# EAGLE design LP_rev1 (EAGLE 9.3.0)

## Sheet 1 of 2
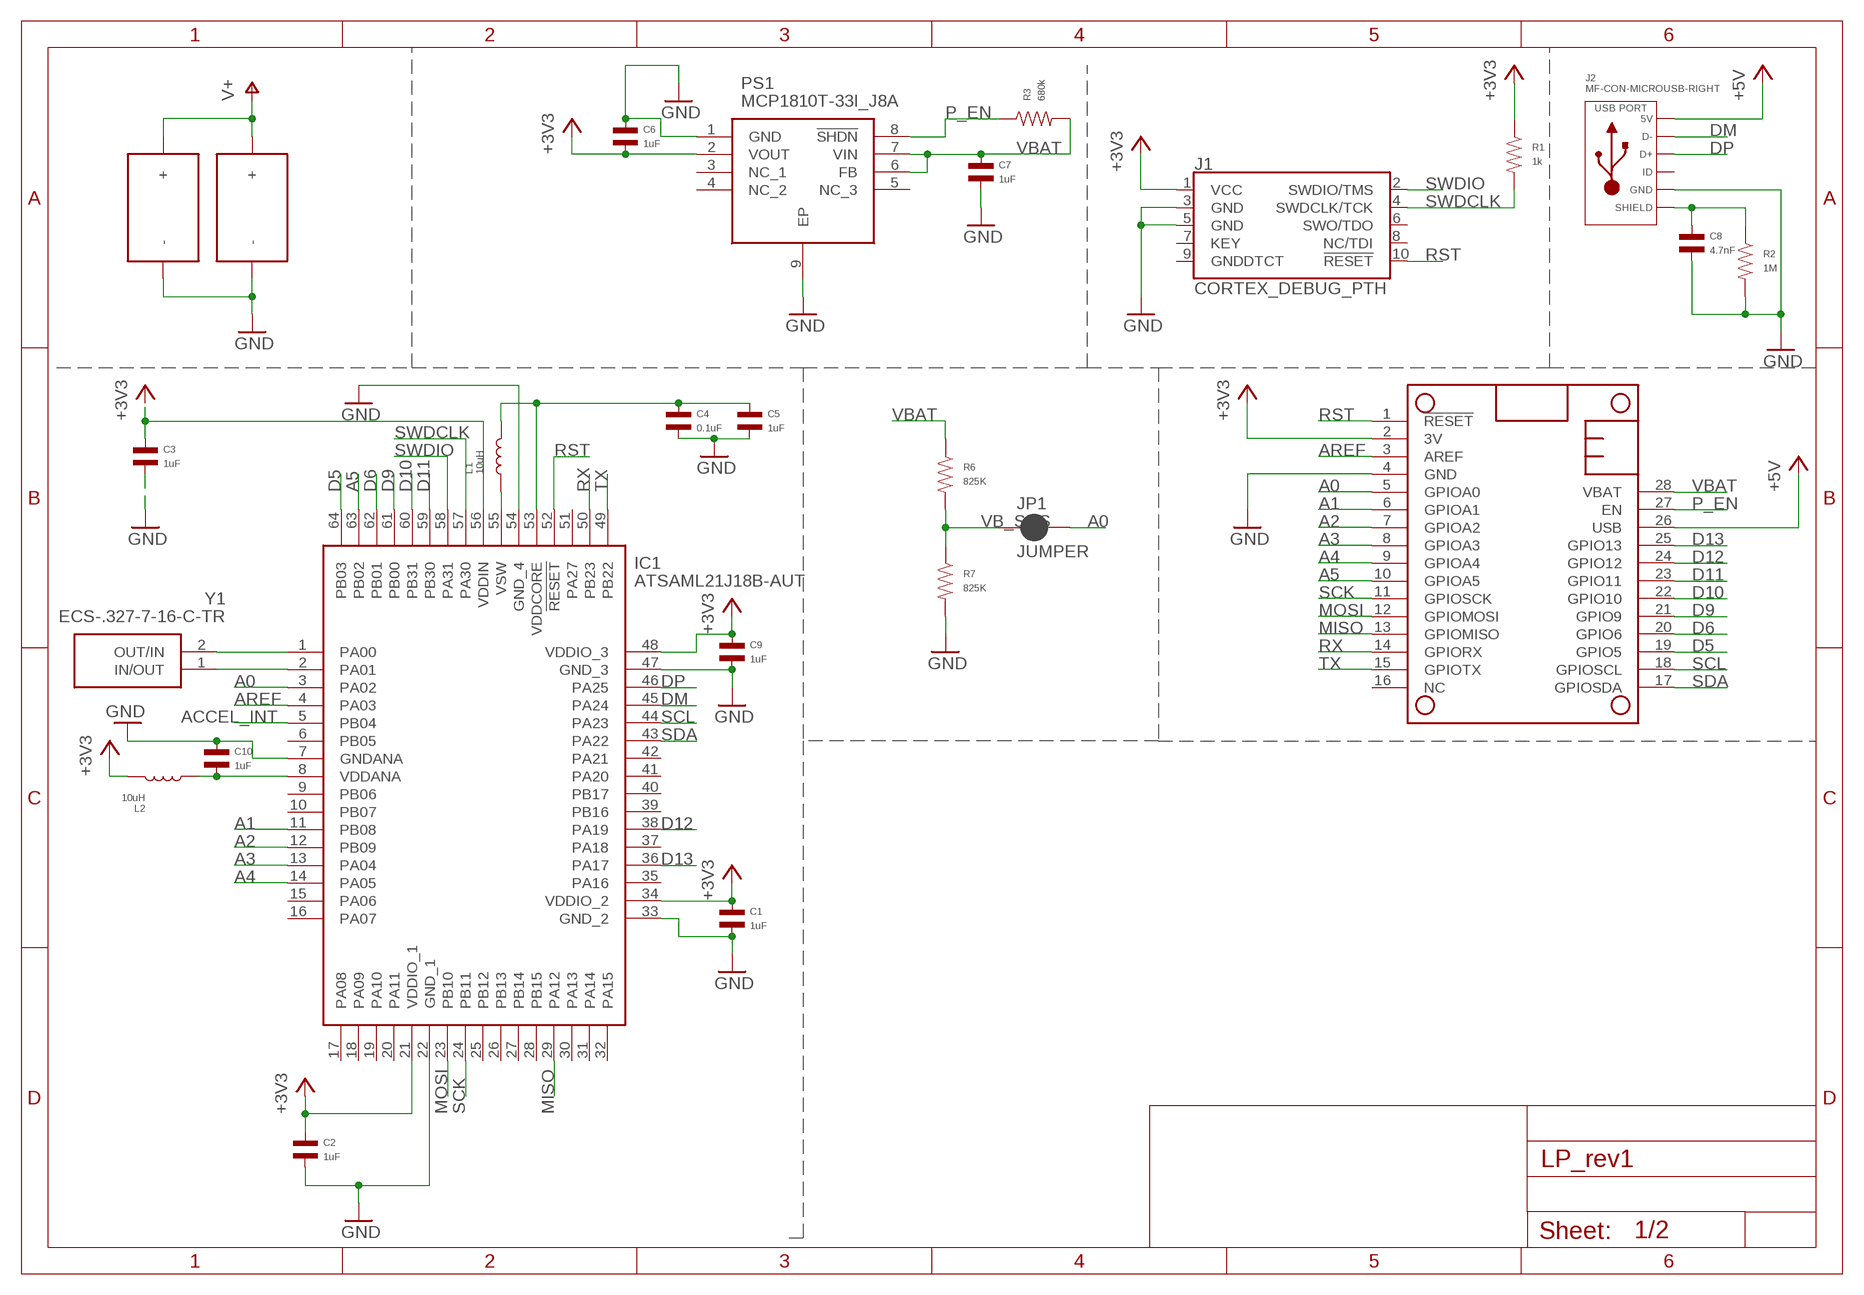
[diagram p0: schematic, sheet 1]

### Parts
C1  1uF  CAPACITOR_NP_0402  [C0402]
C2  1uF  CAPACITOR_NP_0402  [C0402]
C3  1uF  CAPACITOR_NP_0402  [C0402]
C4  0.1uF  CAPACITOR_NP_0402  [C0402]
C5  1uF  CAPACITOR_NP_0402  [C0402]
C6  1uF  CAPACITOR_NP_0402  [C0402]
C7  1uF  CAPACITOR_NP_0402  [C0402]
C8  4.7nF  CAPACITOR_NP_0402  [C0402]
C9  1uF  CAPACITOR_NP_0402  [C0402]
C10  1uF  CAPACITOR_NP_0402  [C0402]
IC1  ATSAML21J18B-AUT  [QFP50P1200X1200X120-64N]
J1  CORTEX_DEBUG_PTH  [2X5-PTH-1.27MM]
J2  MF-CON-MICROUSB-RIGHT  USB_MICRO_RIGHT  [MICROUSB-RIGHT]
JP1  JUMPER  JUMPER-SMT_2_NC_PASTE_NO-SILK  [SMT-JUMPER_2_NC_PASTE_NO-SILK]
L1  10uH  INDUCTOR_0603  [L0603]
L2  10uH  INDUCTOR_0603  [L0603]
MS1  FEATHERWING  [FEATHERWING]
PS1  MCP1810T-33I_J8A  [SON50P200X200X90-9N]
R1  1k  RESISTOR_0402  [R0402]
R2  1M  RESISTOR_0402  [R0402]
R3  680k  RESISTOR_0402  [R0402]
R6  825K  RESISTOR_0402  [R0402]
R7  825K  RESISTOR_0402  [R0402]
U$1  KXOB25-01X8F  [KXOB25-01X8F]
U$2  KXOB25-01X8F  [KXOB25-01X8F]
Y1  ECS-.327-7-16-C-TR  [ECS327516TR]

### Nets
+3V3: C1.P$1 C2.P$1 C3.P$1 C6.P$2 C9.P$1 IC1.21(VDDIO_1) IC1.34(VDDIO_2) IC1.48(VDDIO_3) IC1.56(VDDIN) J1.1(VCC) L2.P$2 MS1.2(3V) PS1.2(VOUT) R1.P$1 ; also sheet 2
+5V: J2.1(5V) MS1.26(USB)
A0: IC1.3(PA02) JP1.2 MS1.5(GPIOA0)
A1: IC1.11(PB08) MS1.6(GPIOA1)
A2: IC1.12(PB09) MS1.7(GPIOA2)
A3: IC1.13(PA04) MS1.8(GPIOA3)
A4: IC1.14(PA05) MS1.9(GPIOA4)
A5: IC1.63(PB02) MS1.10(GPIOA5)
ACCEL_INT: IC1.5(PB04) ; also sheet 2
AREF: IC1.4(PA03) MS1.3(AREF)
D5: IC1.64(PB03) MS1.19(GPIO5)
D6: IC1.62(PB01) MS1.20(GPIO6)
D9: IC1.61(PB00) MS1.21(GPIO9)
D10: IC1.60(PB31) MS1.22(GPIO10)
D11: IC1.59(PB30) MS1.23(GPIO11)
D12: IC1.38(PA19) MS1.24(GPIO12)
D13: IC1.36(PA17) MS1.25(GPIO13)
DM: IC1.45(PA24) J2.2(D-)
DP: IC1.46(PA25) J2.3(D+)
GND: C1.P$2 C2.P$2 C3.P$2 C4.P$2 C5.P$2 C6.P$1 C7.P$2 C8.P$2 C9.P$2 C10.P$1 IC1.7(GNDANA) IC1.22(GND_1) IC1.33(GND_2) IC1.47(GND_3) IC1.54(GND_4) J1.3(GND) J1.5(GND) J2.5(GND) MS1.4(GND) PS1.1(GND) PS1.9(EP) R2.P$2 R7.P$2 U$1.P$2(-) U$2.P$2(-) ; also sheet 2
MISO: IC1.29(PA12) MS1.13(GPIOMISO)
MOSI: IC1.23(PB10) MS1.12(GPIOMOSI)
N$1: C4.P$1 C5.P$1 IC1.53(VDDCORE) L1.P$2
N$2: IC1.1(PA00) Y1.2(OUT/IN)
N$3: IC1.2(PA01) Y1.1(IN/OUT)
N$4: C10.P$2 IC1.8(VDDANA) L2.P$1
N$5: C8.P$1 J2.S1(SLD) J2.S2(SLD) J2.S3(SLD) J2.S4(SLD) J2.S5(SLD) J2.S6(SLD) R2.P$1
N$6: IC1.55(VSW) L1.P$1
P_EN: MS1.27(EN) PS1.8(!SHDN) R3.P$1
RST: IC1.52(!RESET) J1.10(!RESET) MS1.1(!RESET)
RX: IC1.50(PB23) MS1.14(GPIORX)
SCK: IC1.24(PB11) MS1.11(GPIOSCK)
SCL: IC1.44(PA23) MS1.18(GPIOSCL) ; also sheet 2
SDA: IC1.43(PA22) MS1.17(GPIOSDA) ; also sheet 2
SWDCLK: IC1.57(PA30) J1.4(SWDCLK/TCK) R1.P$2
SWDIO: IC1.58(PA31) J1.2(SWDIO/TMS)
TX: IC1.49(PB22) MS1.15(GPIOTX)
V+: U$1.P$1(+) U$2.P$1(+) ; also sheet 2
VB_SNS: JP1.1 R6.P$2 R7.P$1
VBAT: C7.P$1 MS1.28(VBAT) PS1.6(FB) PS1.7(VIN) R3.P$2 R6.P$1 ; also sheet 2
Unconnected: IC1.6(PB05) IC1.9(PB06) IC1.10(PB07) IC1.15(PA06) IC1.16(PA07) IC1.17(PA08) IC1.18(PA09) IC1.19(PA10) IC1.20(PA11) IC1.25(PB12) IC1.26(PB13) IC1.27(PB14) IC1.28(PB15) IC1.30(PA13) IC1.31(PA14) IC1.32(PA15) IC1.35(PA16) IC1.37(PA18) IC1.39(PB16) IC1.40(PB17) IC1.41(PA20) IC1.42(PA21) IC1.51(PA27) J1.6(SWO/TDO) J1.7(KEY) J1.8(NC/TDI) J1.9(GNDDTCT) J2.4(ID) MS1.16(NC) PS1.3(NC_1) PS1.4(NC_2) PS1.5(NC_3)

## Sheet 2 of 2
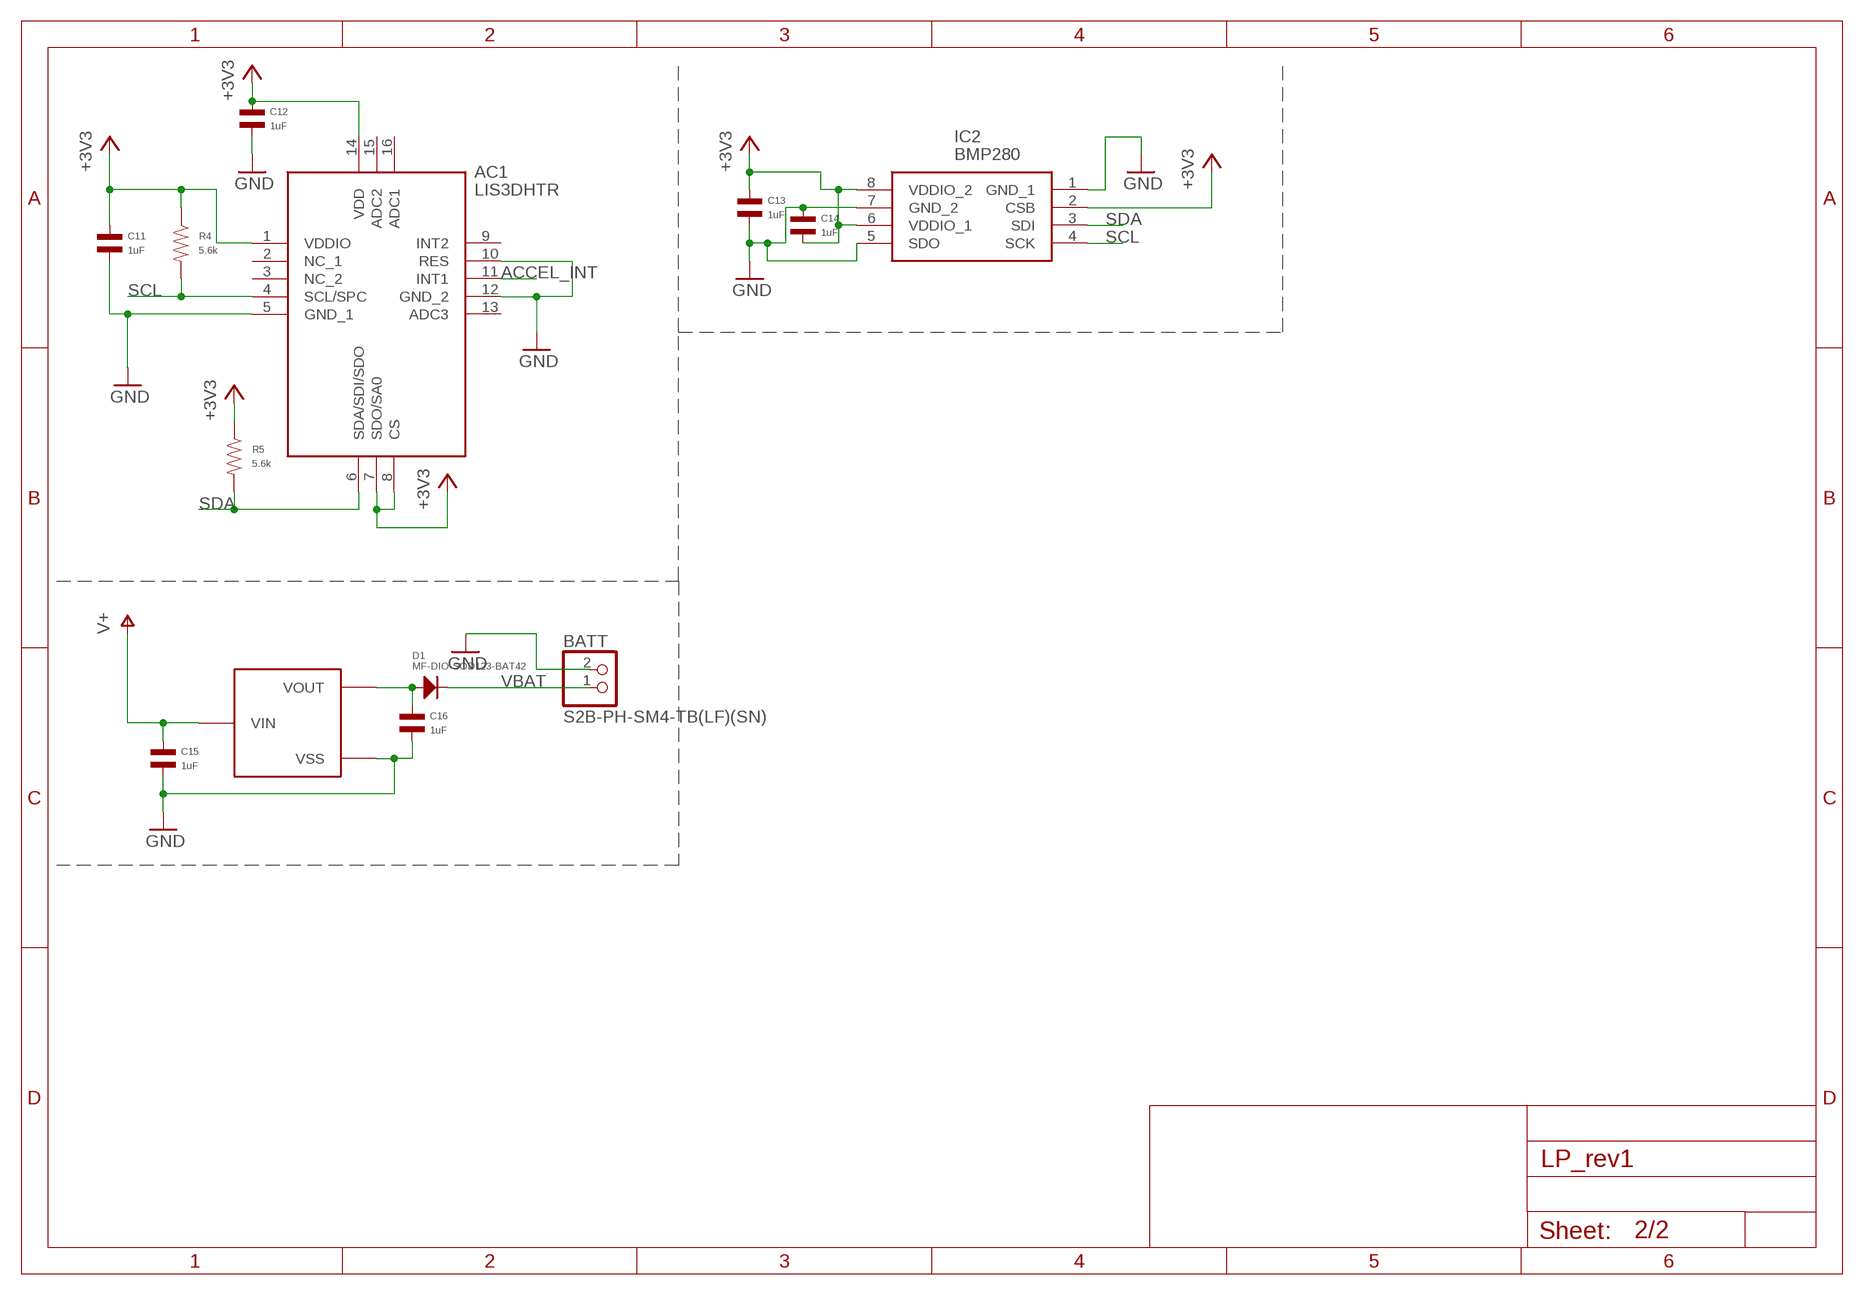
[diagram p1: schematic, sheet 2]

### Parts
AC1  LIS3DHTR  [PQFN50P300X300X100-16N]
BATT  S2B-PH-SM4-TB(LF)(SN)  JST_2PIN-SMT-RA  [JST-PH-2-SMT-RA]
C11  1uF  CAPACITOR_NP_0402  [C0402]
C12  1uF  CAPACITOR_NP_0402  [C0402]
C13  1uF  CAPACITOR_NP_0402  [C0402]
C14  1uF  CAPACITOR_NP_0402  [C0402]
C15  1uF  CAPACITOR_NP_0402  [C0402]
C16  1uF  CAPACITOR_NP_0402  [C0402]
D1  MF-DIO-SOD123-BAT42  DIODES_BAT42_SOD-123  [SOD-123]
IC2  BMP280  [8-PIN-METAL-LID-LGA]
R4  5.6k  RESISTOR_0402  [R0402]
R5  5.6k  RESISTOR_0402  [R0402]
U$3  XC6206P422MR-G  XC6206  [XC6206]

### Nets
+3V3: AC1.1(VDDIO) AC1.7(SDO/SA0) AC1.8(CS) AC1.14(VDD) C11.P$1 C12.P$1 C13.P$1 C14.P$2 IC2.2(CSB) IC2.6(VDDIO_1) IC2.8(VDDIO_2) R4.P$1 R5.P$1 ; also sheet 1
ACCEL_INT: AC1.11(INT1) ; also sheet 1
GND: AC1.5(GND_1) AC1.10(RES) AC1.12(GND_2) BATT.2 C11.P$2 C12.P$2 C13.P$2 C14.P$1 C15.P$2 C16.P$2 IC2.1(GND_1) IC2.5(SDO) IC2.7(GND_2) U$3.P$1(VSS) ; also sheet 1
N$10: C16.P$1 D1.ANODE U$3.P$2(VOUT)
SCL: AC1.4(SCL/SPC) IC2.4(SCK) R4.P$2 ; also sheet 1
SDA: AC1.6(SDA/SDI/SDO) IC2.3(SDI) R5.P$2 ; also sheet 1
V+: C15.P$1 U$3.P$3(VIN) ; also sheet 1
VBAT: BATT.1 D1.CATHODE ; also sheet 1
Unconnected: AC1.2(NC_1) AC1.3(NC_2) AC1.9(INT2) AC1.13(ADC3) AC1.15(ADC2) AC1.16(ADC1)

## Library data of the parts
AC1 = samacsys:LIS3DHTR: Accelerometer 3-Axis 2g/16g 1.8V LGA16 STMicroelectronics LIS3DHTR Accelerometer IC, 3-axis, I2C, SPI 1.71 3.6 V, 16-Pin LGA Source: Datasheet <http://www.st.com/web/en/resource/technical/document/datasheet/CD00274221.pdf>; ALLIED_NUMBER: 70521157; ALLIED_PRICE-STOCK: http://www.alliedelec.com/stmicroelectronics-lis3dhtr/70521157/; DESCRIPTION: Accelerometer 3-Axis 2g/16g 1.8V LGA16 STMicroelectronics LIS3DHTR Accelerometer IC, 3-axis, I2C, SPI 1.71 3.6 V, 16-Pin LGA; HEIGHT: 1mm; MANUFACTURER_NAME: STMicroelectronics; MANUFACTURER_PART_NUMBER: LIS3DHTR; MOUSER_PART_NUMBER: 511-LIS3DHTR; MOUSER_PRICE-STOCK: https://www.mouser.com/Search/Refine.aspx?Keyword=511-LIS3DHTR; RS_PART_NUMBER: 7931364P; RS_PRICE-STOCK: http://uk.rs-online.com/web/p/products/7931364P
BATT = adafruit:JST_2PIN: JST 2-Pin Connectors of various flavors SMT-RA (S2B-PH-SM4) 4UConnector #17311 SMT (B2B-PH-SM4) THM-RA (S2B-PH) THM (B2B-PH)
C1-C16 = MF_Passives:CAPACITOR_NP: Library: MF_Passives Description: Device for Non-Polarized Capacitors. Manufacture part number (MPN) can be added via Attributes. Check https://factory.macrofab.com/parts for the house parts list.; POPULATE: 1
D1 = MF_Discrete_Semiconductor:DIODES: Library: MF_Discrete_Semiconductor Description: Device for Single Packaged Diodes.; HOUSEPART: YES; MPN: MF-DIO-SOD123-BAT42; POPULATE: 1; URL: https://factory.macrofab.com/part/MF-DIO-SOD123-BAT42
IC1 = samacsys:ATSAML21J18B-AUT: MICROCHIP - ATSAML21J18B-AUT. - Cortex-MO+,256KBFLASH, 32 KBSRAM, USB, U Source: Datasheet <http://ww1.microchip.com/downloads/en/DeviceDoc/60001477A.pdf>; DESCRIPTION: MICROCHIP - ATSAML21J18B-AUT. - Cortex-MO+,256KBFLASH, 32 KBSRAM, USB, U; HEIGHT: 1.2mm; MANUFACTURER_NAME: Microchip; MANUFACTURER_PART_NUMBER: ATSAML21J18B-AUT; MOUSER_PART_NUMBER: 556-ATSAML21J18B-AUT; MOUSER_PRICE-STOCK: https://www.mouser.com/Search/Refine.aspx?Keyword=556-ATSAML21J18B-AUT
IC2 = samacsys:BMP280: Digital Pressure Sensor Source: Datasheet <https://ae-bst.resource.bosch.com/media/products/dokumente/bmp280/BST-BMP280-DS001-11.pdf>; DESCRIPTION: Digital Pressure Sensor; HEIGHT: mm; MANUFACTURER_NAME: Bosch Sensortec; MANUFACTURER_PART_NUMBER: bmp280; MOUSER_PART_NUMBER: 262-BMP280; MOUSER_PRICE-STOCK: https://www.mouser.com/Search/Refine.aspx?Keyword=262-BMP280
J1 = SparkFun-Connectors:CORTEX_DEBUG: Cortex Debug Connector - 10 pin Supports JTAG debug, Serial Wire debug, and Serial Wire Viewer. PTH and SMD connector options available. General Connector Information <http://infocenter.arm.com/help/topic/com.arm.doc.faqs/attached/13634/cortex_debug_connectors.pdf> Products: PTH Connector <http://www.digikey.com/product-detail/en/cnc-tech/3220-10-0100-00/1175-1627-ND/3883661> -via Digi-Key SparkFun PSoc <https://www.sparkfun.com/products/13229> SparkFun T <https://www.sparkfun.com/products/13810>
J2 = MF_Connectors:USB: Library: MF_Connectors Description: 5 Pin USB Connectors. SLD is the shield connection. Usually tied to ground through a small ferrite bead.; HOUSEPART: YES; MPN: MF-CON-MICROUSB-RIGHT; POPULATE: 1; URL: https://factory.macrofab.com/part/MF-CON-MICROUSB-RIGHT
JP1 = SparkFun-Jumpers:JUMPER-SMT_2_NC_PASTE: Normally closed solder jumper This jumper has an aperture in the stencil to allow solder paste to bridge the split in the wire so it's normally closed (NC). Wick off the solder to open the connection. Reapply solder to reclose the connection.
L1 L2 = MF_Passives:INDUCTOR: Library: MF_Passives Description: Device for Inductors. Manufacture part number (MPN) can be added via Attributes. Check https://factory.macrofab.com/parts for the house parts list.; POPULATE: 1
MS1 = adafruit:FEATHERWING
PS1 = samacsys:MCP1810T-33I_J8A: LDO Regulator 150mA 3.3V Low IQ VDFN8 Source: Datasheet <https://componentsearchengine.com/Datasheets/2/MCP1810T-33I_J8A.pdf>; DESCRIPTION: LDO Regulator 150mA 3.3V Low IQ VDFN8; HEIGHT: 0.9mm; MANUFACTURER_NAME: Microchip; MANUFACTURER_PART_NUMBER: MCP1810T-33I/J8A; MOUSER_PART_NUMBER: 579-MCP1810T-33I/J8A; MOUSER_PRICE-STOCK: https://www.mouser.com/Search/Refine.aspx?Keyword=579-MCP1810T-33I%2FJ8A; RS_PART_NUMBER: 1468894P; RS_PRICE-STOCK: http://uk.rs-online.com/web/p/products/1468894P
R1-R7 = MF_Passives:RESISTOR: Library: MF_Passives Description: Device for Resistors. Manufacture part number (MPN), Voltage, Tolerance, and Wattage Rating can be added via Attributes. Check https://factory.macrofab.com/parts for the house parts list.; POPULATE: 1
U$1 U$2 = ixys:KXOB25-01X8F
U$3 = torex:XC6206
Y1 = samacsys:ECS-.327-7-16-C-TR: Crystals 32.768kHz 7pF 10ppm -40C +85C Source: Datasheet <https://www.mouser.com/datasheet/2/122/ECX-16-845175.pdf>; DESCRIPTION: Crystals 32.768kHz 7pF 10ppm -40C +85C; HEIGHT: 0.5mm; MANUFACTURER_NAME: ECS; MANUFACTURER_PART_NUMBER: ECS-.327-7-16-C-TR; MOUSER_PART_NUMBER: 520-.327-7-16-CT; MOUSER_PRICE-STOCK: https://www.mouser.com/Search/Refine.aspx?Keyword=520-.327-7-16-CT

## Board
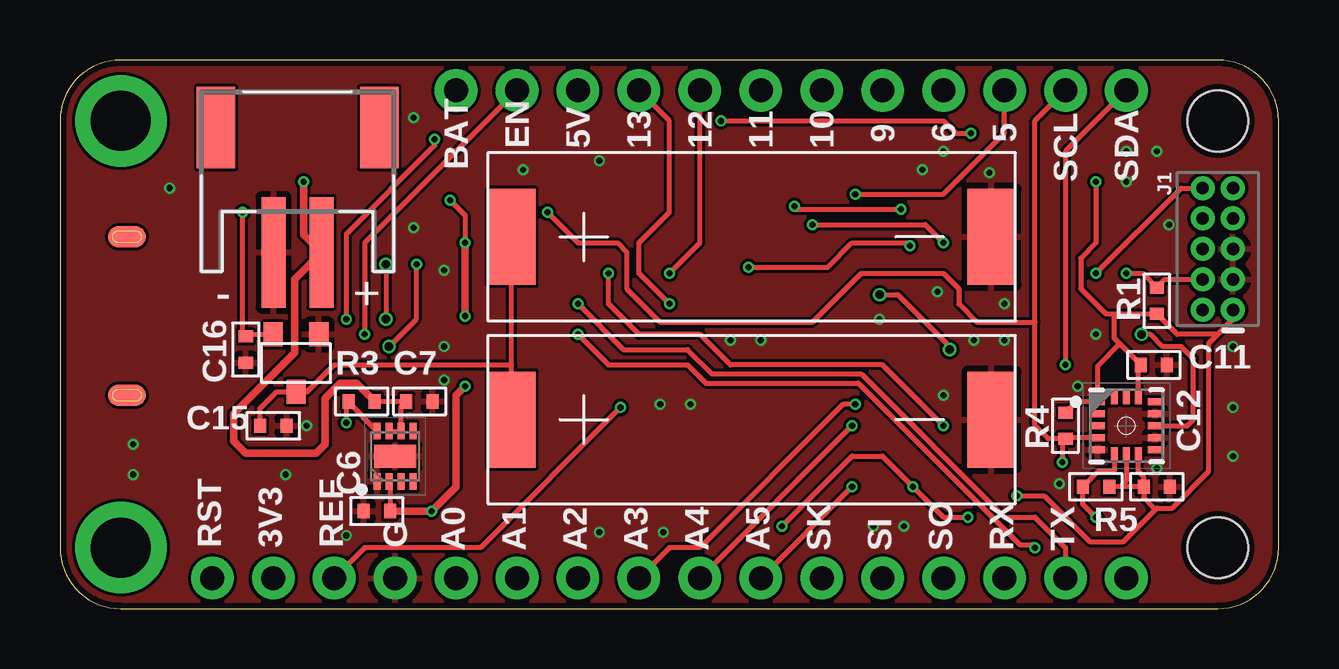
[diagram p2: board, top side]
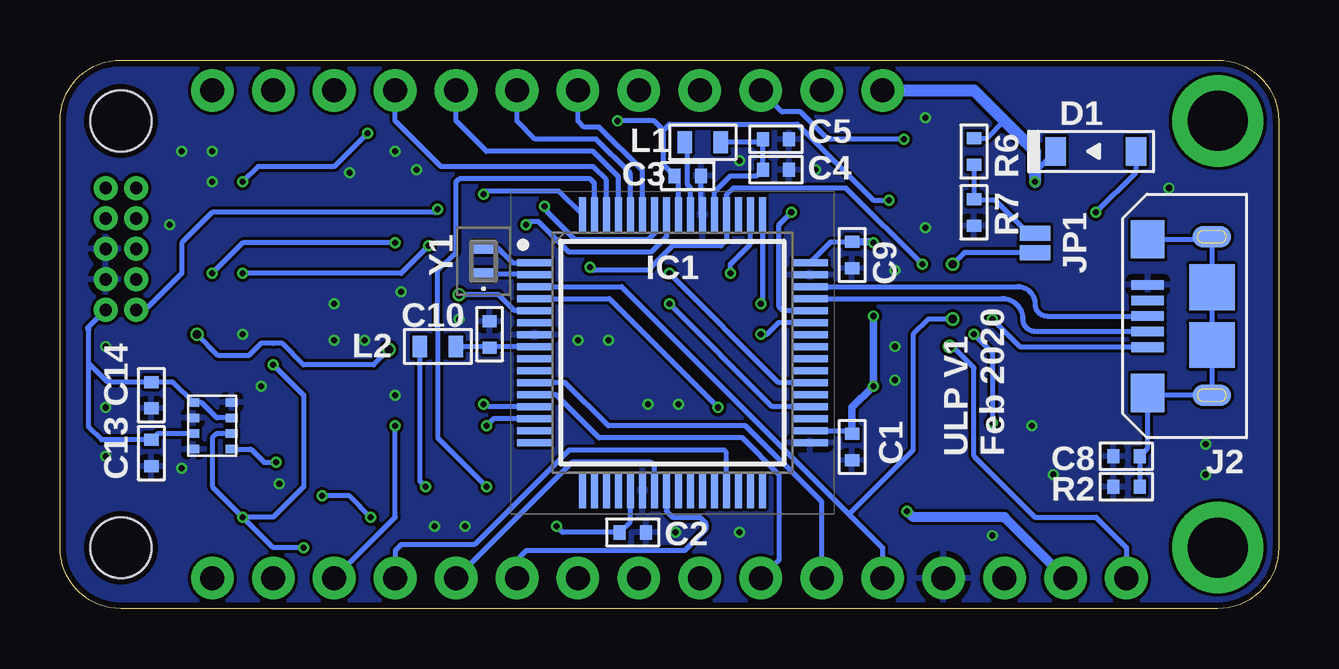
[diagram p3: board, bottom side, seen from below]

Size 50.8 x 22.86 mm. Coordinates in mm from the lower left corner, seen from the top.
Copper layers (1*16): Top 0.035mm / dielectric 1.5mm / Bottom 0.035mm
Design rules "MF_Standard_2_Layer": minimum track width 5mil, minimum drill 10mil, track to track 5mil, track to pad 5mil, pad to pad 5mil, via to via 5mil, smd to smd 0mil, copper to edge 10mil, drill to drill 10mil, minimum pad ring 4mil, minimum via ring 4mil, stop-mask expansion 2mil, vias tented up to drill 25mil, thermal gap 10mil

### Footprints (pad centres in the part's own frame; a part is rotated, then mirrored left to right if it is on the bottom)
PQFN50P300X300X100-16N = smd 0.6 x 0.3: 1 -1.2,1; 2 -1.2,0.5; 3 -1.2,0; 4 -1.2,-0.5; 5 -1.2,-1; 9 1.2,-1; 10 1.2,-0.5; 11 1.2,0; 12 1.2,0.5; 13 1.2,1 | smd 0.3 x 0.6: 6 -0.5,-1.2; 7 0,-1.2; 8 0.5,-1.2; 14 0.5,1.2; 15 0,1.2; 16 -0.5,1.2
JST-PH-2-SMT-RA = smd 1 x 4.6: 1 1,-3.7; 2 -1,-3.7 | smd 1.6 x 3.4: NC1 -3.4,1.5; NC2 3.4,1.5
C0402 = smd 0.5 x 0.6: P$1 -0.55,0; P$2 0.55,0
SOD-123 = smd 0.85 x 1.2: ANODE 1.675,0; CATHODE -1.675,0
QFP50P1200X1200X120-64N = smd 1.475 x 0.3: 1 -5.738,3.75; 2 -5.738,3.25; 3 -5.738,2.75; 4 -5.738,2.25; 5 -5.738,1.75; 6 -5.738,1.25; 7 -5.738,0.75; 8 -5.738,0.25; 9 -5.738,-0.25; 10 -5.738,-0.75; 11 -5.738,-1.25; 12 -5.738,-1.75; 13 -5.738,-2.25; 14 -5.738,-2.75; 15 -5.738,-3.25; 16 -5.738,-3.75; 33 5.738,-3.75; 34 5.738,-3.25; 35 5.738,-2.75; 36 5.738,-2.25; 37 5.738,-1.75; 38 5.738,-1.25; 39 5.738,-0.75; 40 5.738,-0.25; 41 5.738,0.25; 42 5.738,0.75; 43 5.738,1.25; 44 5.738,1.75; 45 5.738,2.25; 46 5.738,2.75; 47 5.738,3.25; 48 5.738,3.75 | smd 0.3 x 1.475: 17 -3.75,-5.738; 18 -3.25,-5.738; 19 -2.75,-5.738; 20 -2.25,-5.738; 21 -1.75,-5.738; 22 -1.25,-5.738; 23 -0.75,-5.738; 24 -0.25,-5.738; 25 0.25,-5.738; 26 0.75,-5.738; 27 1.25,-5.738; 28 1.75,-5.738; 29 2.25,-5.738; 30 2.75,-5.738; 31 3.25,-5.738; 32 3.75,-5.738; 49 3.75,5.738; 50 3.25,5.738; 51 2.75,5.738; 52 2.25,5.738; 53 1.75,5.738; 54 1.25,5.738; 55 0.75,5.738; 56 0.25,5.738; 57 -0.25,5.738; 58 -0.75,5.738; 59 -1.25,5.738; 60 -1.75,5.738; 61 -2.25,5.738; 62 -2.75,5.738; 63 -3.25,5.738; 64 -3.75,5.738
8-PIN-METAL-LID-LGA = smd 0.5 x 0.35: 1 0.8,0.975; 2 0.8,0.325; 3 0.8,-0.325; 4 0.8,-0.975; 5 -0.8,-0.975; 6 -0.8,-0.325; 7 -0.8,0.325; 8 -0.8,0.975
2X5-PTH-1.27MM = drill 0.508 pad 1: 1 -2.54,-0.635; 2 -2.54,0.635; 3 -1.27,-0.635; 4 -1.27,0.635; 5 0,-0.635; 6 0,0.635; 7 1.27,-0.635; 8 1.27,0.635; 9 2.54,-0.635; 10 2.54,0.635
MICROUSB-RIGHT = smd 0.4 x 1.35: 1 -1.3,1.27; 2 -0.65,1.27; 3 0,1.27; 4 0.65,1.27; 5 1.3,1.27 | smd 0.9 x 1.6: S1 -3.3,-1.4; S2 3.3,-1.4 | smd 1.6 x 1.4: S3 -3.2,1.27; S4 3.2,1.27 | smd 1.9 x 1.9: S5 -1.2,-1.405; S6 1.2,-1.405 | smd 0.9 x 1.6 bottom: S7 -3.3,-1.4; S8 3.3,-1.4
SMT-JUMPER_2_NC_PASTE_NO-SILK = smd 0.635 x 1.27: 1 -0.406,0; 2 0.406,0
L0603 = smd 0.6 x 0.9: P$1 -0.75,0; P$2 0.75,0
FEATHERWING = drill 1 pad 1.778: 1 6.35,1.27; 2 8.89,1.27; 3 11.43,1.27; 4 13.97,1.27; 5 16.51,1.27; 6 19.05,1.27; 7 21.59,1.27; 8 24.13,1.27; 9 26.67,1.27; 10 29.21,1.27; 11 31.75,1.27; 12 34.29,1.27; 13 36.83,1.27; 14 39.37,1.27; 15 41.91,1.27; 16 44.45,1.27; 17 44.45,21.59; 18 41.91,21.59; 19 39.37,21.59; 20 36.83,21.59; 21 34.29,21.59; 22 31.75,21.59; 23 29.21,21.59; 24 26.67,21.59; 25 24.13,21.59; 26 21.59,21.59; 27 19.05,21.59; 28 16.51,21.59 | drill 2.5 pad 3.81: P$1 2.54,20.32; P$2 2.54,2.54 | hole 2.54: 48.26,20.32; 48.26,2.54
SON50P200X200X90-9N = smd 0.7 x 0.3: 1 -1.05,0.75; 2 -1.05,0.25; 3 -1.05,-0.25; 4 -1.05,-0.75; 5 1.05,-0.75; 6 1.05,-0.25; 7 1.05,0.25; 8 1.05,0.75 | smd 0.95 x 1.75: 9 0,0
R0402 = smd 0.5 x 0.6: P$1 -0.55,0; P$2 0.55,0
KXOB25-01X8F = smd 2 x 4: P$1 -10,0; P$2 10,0
XC6206 = smd 0.8 x 1: P$1 0,0; P$2 1.9,0; P$3 0.95,2.4
ECS327516TR = smd 0.5 x 1: 1 -0.55,0; 2 0.55,0

### Placement (x,y rotation side)
AC1  44.45,7.62 0 top
BATT  9.91,18.54 0 top
C1  17.78,6.73 270 bottom
C2  26.92,3.17 0 bottom
C3  24.64,18.03 0 bottom
C4  20.95,18.29 0 bottom
C5  20.95,19.56 0 bottom
C6  13.21,4.06 0 top
C7  14.99,8.64 0 top
C8  6.35,6.35 180 bottom
C9  17.78,14.73 270 bottom
C10  32.89,11.43 270 bottom
C11  45.59,10.16 0 top
C12  45.72,5.08 0 top
C13  46.99,6.48 270 bottom
C14  46.99,8.89 90 bottom
C15  8.89,7.62 0 top
C16  7.75,10.79 270 top
D1  7.62,19.05 0 bottom
IC1  25.27,10.67 0 bottom
IC2  44.45,7.62 0 bottom
J1  48.26,14.99 90 top
J2  4.19,12.19 90 bottom
JP1  10.16,15.24 270 bottom
L1  24,19.43 0 bottom
L2  35.05,10.92 180 bottom
MS1  0,0 0 top
PS1  13.97,6.35 90 top
R1  45.72,12.83 90 top
R2  6.35,5.08 180 bottom
R3  12.57,8.64 0 top
R4  41.91,7.62 270 top
R5  43.18,5.08 180 top
R6  12.7,19.05 270 bottom
R7  12.7,16.51 270 bottom
U$1  28.83,15.49 0 top
U$2  28.83,7.87 0 top
U$3  10.79,11.43 180 top
Y1  33.15,14.48 90 bottom

### Tracks (layer width: path | path; a pad name or v marks a point on that pad's centre or on a via)
+3V3  (via drill 0.25)
  Top 0.203: R4.P$1 42.36,8.62 AC1.1 43.25,10.1 44.17,11.03 | C12.P$1 45.17,5.5 44.95,5.72 AC1.8 | AC1.7 44.45,5.33 44.2,5.08 | 44.2,5.08 R5.P$1 | AC1.14 44.95,10.07 C11.P$1 44.17,11.03 | J1.1 48.9,12.06 48.26,11.43 | 48.26,11.43 46.57,11.43 R1.P$1 43.94,12.28 | C12.P$1 44.2,5.08 | C12.P$1 45.17,4.61 45.59,4.19 45.72,4.19 | 45.72,4.19 46.35,4.19 47.88,5.71 47.88,11.05 48.26,11.43 | PS1.2 13.76,5.26 C6.P$2 | v16.26,17.02 16.89,16.38 v16.89,15.24 | v30.1,3.43 33.02,6.35 34.29,6.35 v35.56,5.08 36.83,3.81 v37.85,3.81 | v39.88,4.7 41.02,4.7 42.93,2.79 44.32,2.79 45.72,4.19 | v27.56,20.32 36.83,20.32 37.34,19.81 v37.97,19.81 | v43.18,17.78 43.18,15.24 42.55,14.61 42.55,13.34 43.6,12.28 43.94,12.28 | 44.17,11.03 43.94,11.26 43.94,12.28
  Top 0.305: C6.P$2 v15.49,4.06 16.51,5.08 16.51,8.89 v16.89,9.27 | v16.89,12.19 v16.89,15.24
  Bottom 0.203: IC1.48 18.67,15.28 C9.P$1 | IC1.34 17.92,7.42 C1.P$1 | IC1.21 27.02,3.63 C2.P$1 29.84,3.17 v30.1,3.43 | IC1.56 25.02,17.87 C3.P$1 25.65,18.5 25.65,19.94 | IC2.6 46.72,7.29 C13.P$1 49.06,7.03 49.59,7.56 49.59,10.16 | IC2.2 44.27,7.95 44.92,8.6 IC2.8 46.09,9.44 C14.P$2 48.81,9.44 49.53,10.16 49.59,10.16 | 25.65,19.94 25.4,20.19 20.07,20.19 16.89,17.02 v16.26,17.02 | v37.85,3.81 38.73,4.7 v39.88,4.7 | L2.P$2 35.8,5.32 v35.56,5.08 | 25.65,19.94 26.04,20.32 v27.56,20.32 | v37.97,19.81 39.37,18.41 42.55,18.41 v43.18,17.78 | J1.1 49.66,11.68 49.59,11.62 49.59,10.16
  Bottom 0.305: C1.P$1 17.78,8.38 v16.89,9.27 v16.89,12.19 | v16.89,15.24 16.93,15.28 C9.P$1
  Bottom 0.406: MS1.2 11.43,3.81 15.24,3.81 v15.49,4.06
+5V  (via drill 0.25)
  Top 0.203: v11.94,12.06 11.94,15.62 15.62,19.3 v15.62,19.56
  Bottom 0.203: J2.1 10.77,10.89 v11.94,12.06 | v15.62,19.56 18.8,19.56 19.94,20.7 20.7,20.7 MS1.26
A0  (via drill 0.35)
  Top 0.203: v13.59,14.35 v13.59,12.06
  Bottom 0.203: IC1.3 27.39,13.42 17.91,3.94 | MS1.5 16.51,2.54 17.91,3.94 | JP1.2 13.11,14.83 v13.59,14.35 | v13.59,12.06 14.61,12.06 15.24,11.43 15.24,6.6 17.91,3.94
A1
  Bottom 0.203: MS1.6 19.05,4.45 22.23,7.62 27.94,7.62 29.74,9.42 IC1.11
A2
  Bottom 0.203: MS1.7 20.83,2.03 20.83,5.59 22.35,7.11 28.32,7.11 30.13,8.92 IC1.12
A3  (via drill 0.25)
  Top 0.203: v33.15,8.51 32.64,8.51 26.67,2.54 25.4,2.54 MS1.8
  Bottom 0.203: IC1.13 32.93,8.42 33.02,8.51 v33.15,8.51
A4  (via drill 0.25)
  Top 0.203: v33.02,7.62 MS1.9
  Bottom 0.203: IC1.14 32.72,7.92 v33.02,7.62
A5  (via drill 0.25)
  Top 0.203: v33.02,5.08 MS1.10
  Bottom 0.203: IC1.63 28.52,17.73 28.7,17.91 34.16,17.91 34.29,17.78 34.29,14.86 35.05,14.1 35.05,11.68 35.05,11.43 35.05,7.11 v33.02,5.08
ACCEL_INT  (via drill 0.35)
  Top 0.203: v34.16,13.08 34.92,13.08 37.08,10.92 v37.08,10.79 | AC1.11 46.99,7.62 47.24,7.87 47.24,10.41 46.74,10.92 45.97,10.92 45.47,11.43 v45.09,11.43
  Bottom 0.203: IC1.5 31.85,12.42 32.51,13.08 v34.16,13.08 | v37.08,10.79 37.72,10.16 40.64,10.16 41.53,11.05 41.91,11.05 42.42,11.05 42.93,10.54 44.2,10.54 v45.09,11.43
AREF  (via drill 0.25)
  Top 0.203: v23.37,8.38 17.53,2.54 12.7,2.54 MS1.3
  Bottom 0.203: IC1.4 27.9,12.92 v23.37,8.38
D5  (via drill 0.25)
  Top 0.203: MS1.19 39.37,19.81 36.83,17.27 v33.15,17.27
  Bottom 0.203: IC1.64 30.02,17.4 33.02,17.4 v33.15,17.27
D6
  Bottom 0.203: IC1.62 28.02,17.86 28.57,18.41 34.92,18.41 36.83,20.32 MS1.20
D9
  Bottom 0.203: IC1.61 27.52,18 28.57,19.05 33.02,19.05 34.29,20.32 MS1.21
D10
  Bottom 0.203: IC1.60 27.02,18.13 28.45,19.56 30.99,19.56 31.75,20.32 MS1.22
D11
  Bottom 0.203: IC1.59 26.52,18.27 28.32,20.07 28.96,20.07 29.21,20.32 MS1.23
D12  (via drill 0.25)
  Top 0.203: v25.4,13.97 26.67,15.24 MS1.24
  Bottom 0.203: IC1.38 20.85,9.42 v25.4,13.97
D13  (via drill 0.25)
  Top 0.203: v25.4,12.7 24.13,13.97 24.13,15.24 25.4,16.51 25.4,20.32 MS1.25
  Bottom 0.203: IC1.36 21.12,8.42 v25.4,12.7
DM
  Bottom 0.203: 5.48,11.56 arc90 J2.2 arc-90 5.48,11.56 | IC1.45 11.52,12.92 arc90 10.67,12.06 arc-90 10.16,11.56 5.48,11.56
DP
  Bottom 0.203: IC1.46 10.88,13.42 arc90 10.16,12.7 arc-90 9.65,12.19 J2.3
GND  (via drill 0.25)
  Bottom 0.203: IC1.54 24.09,16.47 C3.P$2
  other vias: 36.83,8.89 39.37,11.18 34.16,12.06 43.18,11.43 44.45,19.05 45.72,19.05 38.73,18.16 25.02,8.51 26.29,8.51 22.48,3.17 25.15,3.17 11.94,3.05 9.4,5.59 3.05,6.86 3.05,5.59 4.57,17.53 14.73,20.45 19.3,18.29 22.48,18.67 16,14.1 38.1,11.18 36.58,13.21 36.83,19.05 35.94,18.29 44.45,17.78 46.23,16 27.94,11.18 29.21,11.18 39.37,12.7 48.9,8.38 48.9,6.35 42.42,9.27 41.66,5.21 45.72,5.84 10.29,7.62 33.91,3.43 35.18,3.43 14.73,15.88 16,10.92 16,9.53 48.9,10.92
  pour Top: 0,0 52.07,0 52.07,24.13 0,24.13
  pour Bottom: 0,0 53.34,0 53.34,25.4 0,25.4
MISO
  Bottom 0.203: IC1.29 23.02,6.51 23.11,6.6 29.59,6.6 33.53,2.67 36.58,2.67 36.83,2.41 MS1.13
MOSI
  Bottom 0.203: IC1.23 26.02,5.96 26.16,6.1 29.46,6.1 MS1.12
N$1
  Bottom 0.203: L1.P$2 21.63,19.43 C5.P$1 C4.P$1 21.76,18.03 22.86,18.03 23.52,17.37 IC1.53
N$2
  Bottom 0.203: Y1.2 32.55,15.03 31.94,14.42 IC1.1
N$3
  Bottom 0.203: IC1.2 31.02,13.93 Y1.1
N$4
  Bottom 0.203: IC1.8 32.85,10.92 C10.P$2 32.94,10.92 L2.P$1
N$5
  Bottom 0.203: R2.P$1 C8.P$1 5.46,6.69 J2.S3 5.36,8.89 J2.S1 J2.S5 J2.S6 J2.S2 2.89,15.39 J2.S4
N$6
  Bottom 0.203: IC1.55 24.52,17.54 24.64,17.65 24.64,19.32 L1.P$1
N$10  (via drill 0.25)
  Top 0.203: U$3.P$2 7.83,11.43 C16.P$1 7.62,11.47 v7.62,16.51
  Bottom 0.203: v7.62,16.51 5.95,18.18 D1.ANODE
P_EN  (via drill 0.25)
  Top 0.203: PS1.8 12.02,8.6 R3.P$1 11.94,8.55 v11.94,7.75 | MS1.27 12.7,15.24 v12.7,11.43
  Bottom 0.203: v12.7,11.43 11.94,10.67 v11.94,7.75
RST  (via drill 0.25, 0.35)
  Top 0.203: v28.7,14.22 32,14.22 33.02,15.24 35.31,15.24 v35.43,15.11 | v43.18,13.97 46.74,17.53 J1.10 | v14.86,14.35 14.86,12.06 v13.72,10.92
  Bottom 0.203: v28.7,14.22 28.57,14.1 26.29,14.1 25.27,15.11 23.24,15.11 23.02,15.33 IC1.52 23.02,17.24 22.73,17.53 18.03,17.53 v14.86,14.35 | v35.43,15.11 36.58,13.97 v43.18,13.97 | MS1.1 6.35,2.54 7.62,3.81 10.16,3.81 12.7,6.35 12.7,10.03 13.59,10.92 v13.72,10.92
RX  (via drill 0.25)
  Top 0.203: v36.83,7.62 34.29,10.16 27.94,10.16 26.67,11.43 24.13,11.43 22.86,12.7 v22.86,13.97
  Bottom 0.203: MS1.14 36.83,3.81 v36.83,7.62 | v22.86,13.97 22.86,14.35 22.02,15.19 IC1.50
SCK
  Bottom 0.203: MS1.11 31.62,1.4 31.62,2.16 31.37,2.41 24.77,2.41 23.88,3.3 23.88,3.56 24.13,3.81 25.27,3.81 25.52,4.06 IC1.24
SCL  (via drill 0.25)
  Top 0.203: R4.P$2 41.78,6.94 v41.78,6.1 | AC1.4 41.96,7.12 R4.P$2 | v20.32,16.51 21.59,15.24 23.24,15.24 23.62,14.86 23.62,13.34 25.02,11.94 31.37,11.94 33.4,13.97 36.83,13.97 37.47,13.34 37.47,12.7 38.23,11.94 40.64,11.94 | MS1.18 40.64,20.32 40.64,11.94 | R4.P$2 41.19,7.07 40.64,7.62 40.64,11.94
  Bottom 0.203: IC2.4 42.84,6.64 42.29,6.1 v41.78,6.1 | IC1.44 20.67,12.42 20.83,12.57 20.83,16 v20.32,16.51
SDA  (via drill 0.25)
  Top 0.203: v43.18,3.81 42.63,4.36 R5.P$2 43.27,5.71 43.94,5.71 AC1.6 | MS1.17 41.91,19.05 v41.91,10.16 | v21.59,11.43 22.86,10.16 26.16,10.16 26.92,9.4 33.27,9.4 40.01,2.67 40.51,2.67 v40.64,2.54
  Bottom 0.203: IC2.3 44.27,7.29 44.45,7.11 44.45,5.08 v43.18,3.81 | v41.91,10.16 40.64,8.89 40.64,5.08 41.91,3.81 v43.18,3.81 | IC1.43 20.85,11.92 21.34,11.43 v21.59,11.43 | v40.64,2.54 41.91,2.54 v43.18,3.81
SWDCLK  (via drill 0.25)
  Top 0.203: J1.4 46.06,13.72 R1.P$2 45.13,13.97 v44.45,13.97 | v31.37,16 36.07,16 v36.83,15.24
  Bottom 0.203: IC1.57 25.52,15.5 26.16,14.86 29.59,14.86 30.86,16.13 31.24,16.13 v31.37,16 | v36.83,15.24 43.18,15.24 v44.45,13.97
SWDIO  (via drill 0.25)
  Top 0.203: v30.61,16.76 30.73,16.64 v35.05,16.64
  Bottom 0.203: IC1.58 26.02,15.63 26.29,15.37 29.34,15.37 30.48,16.51 30.48,16.64 v30.61,16.76 | v35.05,16.64 35.18,16.51 44.45,16.51 45.72,15.24 45.72,13.97 47.24,12.45 J1.2
TX  (via drill 0.25)
  Top 0.203: v21.59,12.7 23.5,10.79 26.16,10.79 27.18,9.78 31.75,9.78 32.38,9.78 33.4,9.78 39.37,3.81 40.64,3.81 41.91,2.54 MS1.15
  Bottom 0.203: IC1.49 21.52,12.77 v21.59,12.7
V+
  Top 0.203: C15.P$1 8.34,8.34 9.03,9.03 U$3.P$3 10.3,9.03 11.43,10.16 18.83,10.16 | U$2.P$1 18.83,10.16 | 18.83,10.16 U$1.P$1
VB_SNS
  Bottom 0.203: R6.P$2 R7.P$1 12.66,17.02 11.81,17.02 10.44,15.65 JP1.1
VBAT  (via drill 0.25)
  Top 0.203: PS1.7 PS1.6 14.22,8.42 C7.P$1 R3.P$2
  Top 0.305: R3.P$2 12.36,9.4 11.68,9.4 11.05,8.76 11.05,6.86 10.67,6.48 7.75,6.48 7.24,6.99 7.24,8.13 9.78,10.67 9.78,12.06 9.78,13.71 BATT.1 10.16,15.59 v10.16,17.78
  Bottom 0.203: D1.CATHODE 10.16,18.18 v10.16,17.78 | R6.P$1 12.15,19.6 11.43,20.32
  Bottom 0.508: MS1.28 12.7,21.59 11.43,20.32 10.16,19.05 v10.16,17.78

### Text on the board
tNames: EN | 5V | 13 | 12 | 11 | 10 | 9 | 6 | 5 | BAT | SCL | SDA | RST | 3V3 | REF | G | A0 | A1 | A2 | A3 | A4 | A5 | SK | SI | SO | RX | TX
bNames: ULP V1 / Feb 2020